# Altium schematic sheet CW340_USBHUB.SchDoc: USB Hub
size Letter; Organization: NewAE Technology Inc.; Address1: 1083 Queen St., Suite 196; Address2: Halifax; Address3: NS; Address4: Canada B3H 0B2; DocumentNumber: .; Revision: .; SheetNumber: 6; SheetTotal: 31; SheetApproved: YES
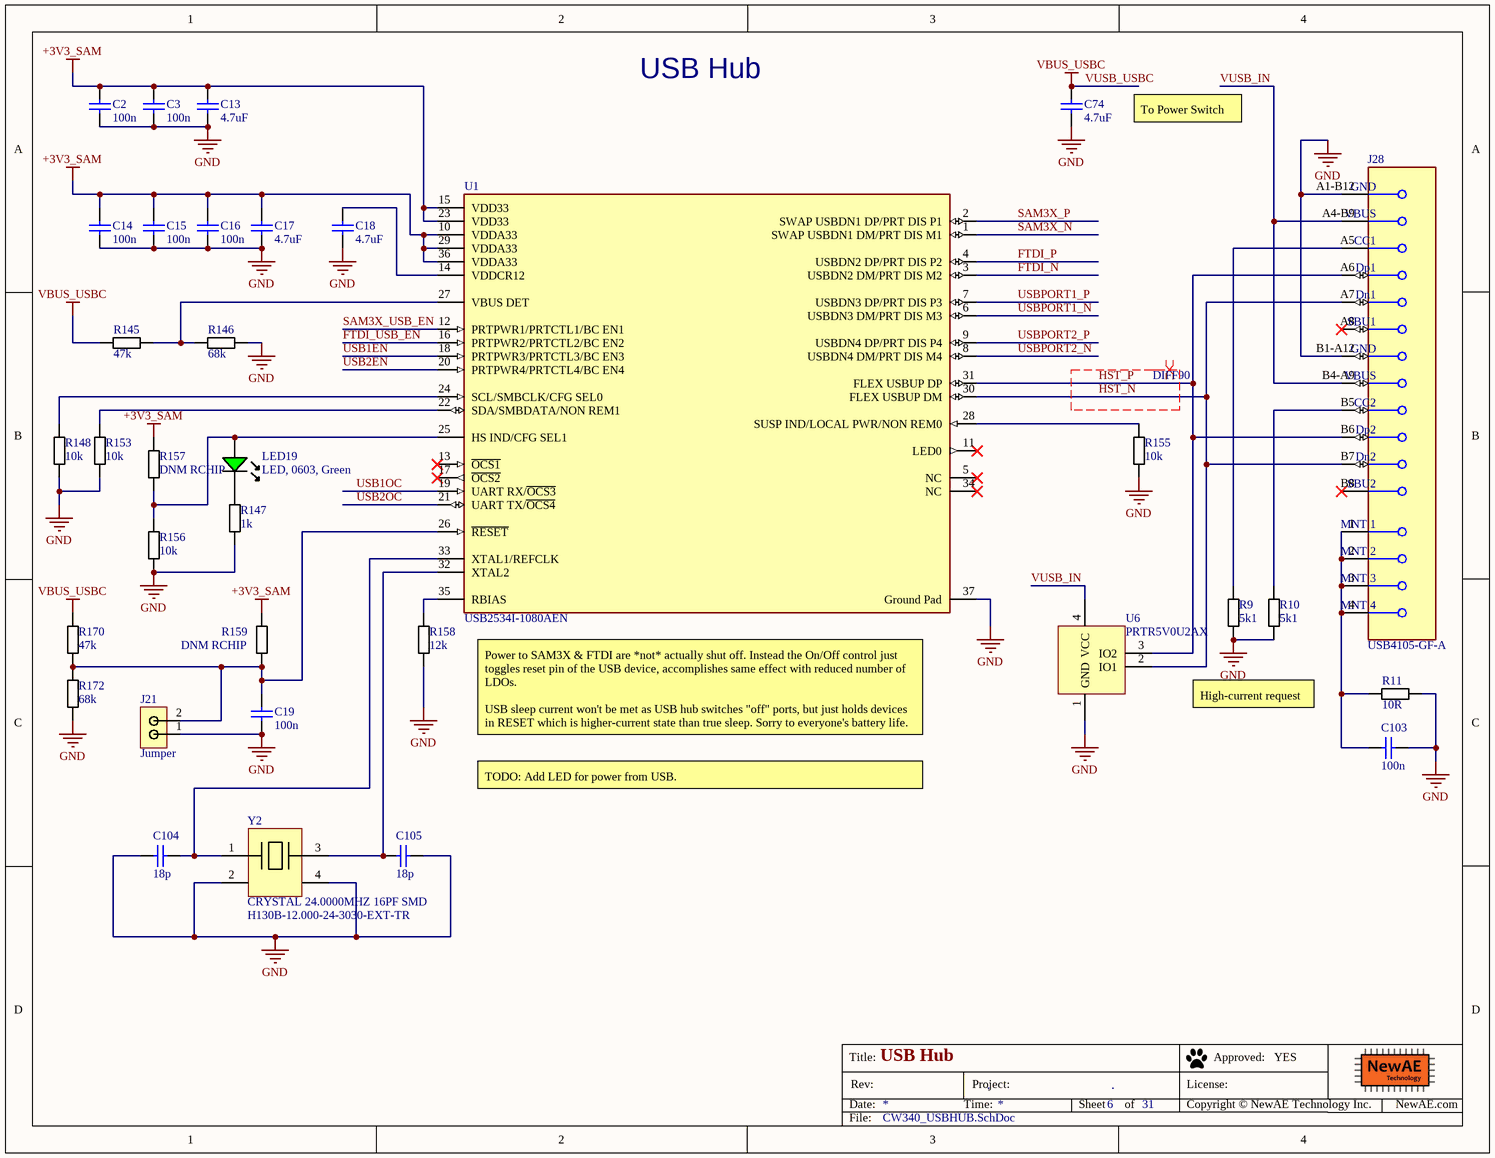
[diagram p0: CW340_USBHUB.SchDoc]

## Parts
C2  100n  [CAPC0402_M]
C3  100n  [CAPC0402_M]
C13  4.7uF  [CAPC0805_M]
C14  100n  [CAPC0402_M]
C15  100n  [CAPC0402_M]
C16  100n  [CAPC0402_M]
C17  4.7uF  [CAPC0805_M]
C18  4.7uF  [CAPC0805_M]
C19  100n  [CAPC0402_M]
C74  4.7uF  [CAPC0805_M]
C103  100n  [CAPC0603_M]
C104  18p  [CAPC0402_M]
C105  18p  [CAPC0402_M]
J21  Jumper  [2x2.54mm_Header]
J28  USB4105-GF-A  [FP-USB4105-GF-A-MFG]
LED19  LED, 0603, Green  [LED-0603-GREEN]
R9  5k1  [RESC1608X55N]
R10  5k1  [RESC1608X55N]
R11  10R  [RESC1608X55N]
R145  47k  [RESC1608X55N]
R146  68k  [RESC1608X55N]
R147  1k  [RESC1608X55N]
R148  10k  [RESC1608X55N]
R153  10k  [RESC1608X55N]
R155  10k  [RESC1608X55N]
R156  10k  [RESC1608X55N]
R157  DNM RCHIP  [RESC1608X55N]
R158  12k  [RESC1608X55N]
R159  DNM RCHIP  [RESC1608X55N]
R170  47k  [RESC1608X55N]
R172  68k  [RESC1608X55N]
U1  USB2534I-1080AEN  [FP-36SQFN-3706-6x6B-IPC_C]
U6  PRTR5V0U2AX  [SOT143B]
Y2  CRYSTAL 24.0000MHZ 16PF SMD  Manufacturer Part Number: H130B-12.000-24-3030-EXT-TR  [5x3.2MM XTAL]

## Nets
+3V3_SAM: C2.1 C3.1 C13.1 C14.1 C15.1 C16.1 C17.1 R157.1 R159.1 U1.10(VDDA33) U1.15(VDD33) U1.23(VDD33) U1.29(VDDA33) U1.36(VDDA33)
GND: C2.2 C3.2 C13.2 C14.2 C15.2 C16.2 C17.2 C18.1 C19.2 C74.2 C103.2 C104.1 C105.2 J21.1 J28.A1-B12(GND) J28.B1-A12(GND) R9.2 R10.2 R11.2 R146.2 R147.2 R148.1 R153.1 R155.1 R156.2 R158.2 R172.1 U1.37(Ground_Pad) U6.1(GND) Y2.2 Y2.4
VUSB_USBC: C74.1 R145.1 R170.1  [also labelled VBUS_USBC]
FTDI_N: U1.3(USBDN2_DM/PRT_DIS_M2)
FTDI_P: U1.4(USBDN2_DP/PRT_DIS_P2)
FTDI_USB_EN: U1.16(PRTPWR2/PRTCTL2/BC_EN2)
HST_N: J28.A7(Dn1) J28.B7(Dn2) U1.30(FLEX_USBUP_DM) U6.2(IO1)
HST_P: J28.A6(Dp1) J28.B6(Dp2) U1.31(FLEX_USBUP_DP) U6.3(IO2)
SAM3X_N: U1.1(SWAP_USBDN1_DM/PRT_DIS_M1)
SAM3X_P: U1.2(SWAP_USBDN1_DP/PRT_DIS_P1)
SAM3X_USB_EN: U1.12(PRTPWR1/PRTCTL1/BC_EN1)
USB1EN: U1.18(PRTPWR3/PRTCTL3/BC_EN3)
USB1OC: U1.19(UART_RX/~{OCS3})
USB2EN: U1.20(PRTPWR4/PRTCTL4/BC_EN4)
USB2OC: U1.21(UART_TX/~{OCS4})
USBPORT1_N: U1.6(USBDN3_DM/PRT_DIS_M3)
USBPORT1_P: U1.7(USBDN3_DP/PRT_DIS_P3)
USBPORT2_N: U1.8(USBDN4_DM/PRT_DIS_M4)
USBPORT2_P: U1.9(USBDN4_DP/PRT_DIS_P4)
VUSB_IN: J28.A4-B9(VBUS) J28.B4-A9(VBUS) U6.4(VCC)
NetC18_2: C18.2 U1.14(VDDCR12)
NetC19_1: C19.1 J21.2 R159.2 R170.2 R172.2 U1.26(~{RESET})
NetC103_1: C103.1 J28.1(MNT_1) J28.2(MNT_2) J28.3(MNT_3) J28.4(MNT_4) R11.1
NetC104_2: C104.2 U1.33(XTAL1/REFCLK) Y2.1
NetC105_1: C105.1 U1.32(XTAL2) Y2.3
NetJ28_A5: J28.A5(CC1) R9.1
NetJ28_B5: J28.B5(CC2) R10.1
NetLED19_A: LED19.A R156.1 R157.2 U1.25(HS_IND/CFG_SEL1)
NetLED19_K: LED19.K R147.1
NetR145_2: R145.2 R146.1 U1.27(VBUS_DET)
NetR148_2: R148.2 U1.24(SCL/SMBCLK/CFG_SEL0)
NetR153_2: R153.2 U1.22(SDA/SMBDATA/NON_REM1)
NetR155_2: R155.2 U1.28(SUSP_IND/LOCAL_PWR/NON_REM0)
NetR158_1: R158.1 U1.35(RBIAS)

Not connected (* = marked no-connect by the designer): J28 A8(SBU1)* B8(SBU2)*; U1 5(NC)* 11(LED0)* 13(~{OCS1})* 17(~{OCS2})* 34(NC)*

## Layout directives
differential pair; differential pair class DIFF90: HST_N, HST_P

## Notes on the sheet
- USB Hub
- To Power Switch
- High-current request
- Power to SAM3X & FTDI are *not* actually shut off. Instead the On/Off control just toggles reset pin of the USB device, accomplishes same effect with reduced number of LDOs.
  USB sleep current won't be met as USB hub switches "off" ports, but just holds devices in RESET which is higher-current state than true sleep. Sorry to everyone's battery life.
- TODO: Add LED for power from USB.
- Title:
- Date:
- Rev:
- Time:
- Project:
- Sheet
- of
- License:
- Copyright © NewAE Technology Inc.
- Approved:
- NewAE.com
- File:

## Library data of the parts
C2 C3 C14-C16 C19 = CCHIP-100n-0402: 100n, 0402; Manufacture Part Number 1: CGA2B3X7R1V104K050BB; Component Group: Capacitor; Case-EIA: 0402; Part Number: CCHIP-100n-0402; Footprint: 0402; Pin Count: 2; Value: 100n; Mounting Technology: SMT; Component Kind: Standard; Component Type: Standard; Supplier 1: Digi-Key; Supplier Part Number 1: 445-6901-1-ND
C13 C17 C18 C74 = CCHIP-4u7-0805-35V: 4u7, 35V, 0805, Ceramic; Manufacture 1: Murata; Manufacture Part Number 1: GRT21BC8YA475KE13L; Component Group: Capacitor; Case-EIA: 0805; Case-Metric: 1608; Rated Voltage: 35VDC; Tolerance: 10%; Part Number: CCHIP-4u7-0805-35V; Footprint: 0805; Pin Count: 2; Supplier 1: Digi-Key; Supplier Part Number 1: 490-12361-1-ND; Value: 4.7uF; Mounting Technology: SMT; Temperature Range: -55C to 85C; Component Kind: Standard; Component Type: Standard
C103 = CCHIP-100n-0603: 100n, 0603; Manufacture 1: Kemet; Manufacture Part Number 1: C0603C104K5RACTU; Component Group: Capacitor; Case-EIA: 0603; Case-Metric: 1608; Rated Voltage: 50VDC; Part Number: CCHIP-100n-0603; Footprint: 0603; Pin Count: 2; Supplier 1: Digi-Key; Supplier Part Number 1: 399-5089-2-ND; Value: 100n; Mounting Technology: SMT; Component Kind: Standard; Component Type: Standard
C104 C105 = CCHIP-18p-0402: 18p, 0402; Manufacture Part Number 1: GRM1555C1H180JA01D; Component Group: Capacitor; Case-EIA: 0402; Part Number: CCHIP-18p-0402; Footprint: 0402; Pin Count: 2; Supplier 1: Digi-Key; Supplier Part Number 1: 490-5858-1-ND; Value: 18p; Mounting Technology: SMT; Component Kind: Standard; Component Type: Standard
J21 = 2_PIN_JUMPER: 1x2 2.54mm header, male pins; Manufacture 1: Harwin; Manufacture Part Number 1: M20-9990246; Component Group: PCB Feature; PP Material Stack: 0; Part Number: 2_PIN_JUMPER; Pin Count: 2; Supplier 1: Digi-Key; Supplier Part Number 1: 952-2262-ND; Mounting Technology: Through-hole; RoHS: Yes; Component Kind: Standard; Component Type: Standard; PP Rotation: 0
J28 = CMP-245163-000001-1: CONN RCPT USB2.0 TYPEC 5A; Manufacturer: GCT; Voltage Rating: 20V; Is Female: yes; Current Rating: 5/6.25/1.25/0.25A; Number Of Contacts: 16; Conn Orientation: Right Angle; Device Class L1: Connectors; Category: Conn; Lead Free: Yes; RoHS: TRUE; Temperature Range High: +85°C; Digikey Description: CONN RCPT USB2.0 TYPEC 5A; Device Class L3: unset; ComponentLink2Description: Datasheet; Manufacturer Part Number: USB4105-GF-A; Package: 0; Usb Standard: USB 2.0; Device Class L2: USB Connectors; Automotive: No; Temperature Range Low: -40°C; Height: 3.46mm; Temperature: -40°C to +85°C; Contact Material: Gold,Nickel; ComponentLink2URL: https://gct.co/files/drawings/usb4105.pdf; Octopart: https://octopart.com/usb4105-gf-a-gct-106627878
LED19 = LEDCHIP_0603_GREEN: Chip LED, Green; Manufacture 1: Kingbright; Manufacture Part Number 1: APT1608CGCK; Component Group: Optical; PP Material Stack: 16; PP Rotation: -90; Part Number: LEDCHIP_0603_GREEN; Pin Count: 2; Supplier 1: Digi-Key; Supplier Part Number 1: 754-1116-1-ND; Mounting Technology: SMT; Component Kind: Standard; Component Type: Standard
R9 R10 = RCHIP-5K1-0603: 5k1 res, 0603, 1%, 1/10W; Manufacture 1: Yageo; Manufacture Part Number 1: RC0603FR-075K1L; Component Group: Resistor; Case-EIA: 0603; Case-Metric: 1608; Rated Power: 0.1W; Rated Voltage: 75VDC; Part Number: RCHIP-5K1-0603; Footprint: 0603; Pin Count: 2; Supplier 1: Digi-Key; Supplier Part Number 1: 311-5.10KHRCT-ND; Value: 5k1; Tolerance: 1%; Mounting Technology: SMT; Temperature Range: -55C to 155C; Component Kind: Standard; Component Type: Standard
R11 = RCHIP-10R-0603: 10R res, 0603, 1%, 1/10W; Manufacture 1: Yageo; Manufacture Part Number 1: RC0603FR-0710RL; Component Group: Resistor; Case-EIA: 0603; Case-Metric: 1608; Rated Power: 0.1W; Rated Voltage: 75VDC; Part Number: RCHIP-10R-0603; Footprint: 0603; Pin Count: 2; Supplier 1: Digi-Key; Supplier Part Number 1: 311-10.0HRCT-ND; Value: 10R; Tolerance: 1%; Mounting Technology: SMT; Temperature Range: -55C to 155C; Component Kind: Standard; Component Type: Standard
R145 R170 = RCHIP-47K-0603: 47k res, 0603, 1%, 1/10W; Manufacture 1: Yageo; Manufacture Part Number 1: RC0603FR-0747KL; Component Group: Resistor; Case-EIA: 0603; Case-Metric: 1608; Rated Power: 0.1W; Rated Voltage: 75VDC; Part Number: RCHIP-47K-0603; Footprint: 0603; Pin Count: 2; Supplier 1: Digi-Key; Supplier Part Number 1: 311-47.0KHRCT-ND; Value: 47k; Tolerance: 1%; Mounting Technology: SMT; Temperature Range: -55C to 155C; Component Kind: Standard; Component Type: Standard
R146 R172 = RCHIP-68K-0603: 68k res, 0603, 1%, 1/10W; Manufacture 1: Yageo; Manufacture Part Number 1: RC0603FR-0768KL; Component Group: Resistor; Case-EIA: 0603; Case-Metric: 1608; Rated Power: 0.1W; Rated Voltage: 75VDC; Part Number: RCHIP-68K-0603; Footprint: 0603; Pin Count: 2; Supplier 1: Digi-Key; Supplier Part Number 1: 311-68.0KHRCT-ND; Value: 68k; Tolerance: 1%; Mounting Technology: SMT; Temperature Range: -55C to 155C; Component Kind: Standard; Component Type: Standard
R147 = RCHIP-1K-0603: 1k res, 0603, 1%, 1/10W; Manufacture 1: Yageo; Manufacture Part Number 1: RC0603FR-071KL; Component Group: Resistor; Case-EIA: 0603; Case-Metric: 1608; Rated Power: 0.1W; Rated Voltage: 75VDC; Part Number: RCHIP-1K-0603; Footprint: 0603; Pin Count: 2; Supplier 1: Digi-Key; Supplier Part Number 1: 311-1.00KHRCT-ND; Value: 1k; Tolerance: 1%; Mounting Technology: SMT; Temperature Range: -55C to 155C; Component Kind: Standard; Component Type: Standard
R148 R153 R155 = RCHIP-10K-0603: 10k res, 0603, 1%, 1/10W; Manufacture 1: Yageo; Manufacture Part Number 1: RC0603FR-0710KL; Component Group: Resistor; Case-EIA: 0603; Case-Metric: 1608; Rated Power: 0.1W; Rated Voltage: 75VDC; Part Number: RCHIP-10K-0603; Footprint: 0603; Pin Count: 2; Supplier 1: Digi-Key; Supplier Part Number 1: 311-10.0KHRCT-ND; Value: 10k; Tolerance: 1%; Mounting Technology: SMT; Temperature Range: -55C to 155C; Component Kind: Standard; Component Type: Standard
R156 = RCHIP-10k-0603: 10k res, 0603, 1%, 1/10W; Manufacture 1: Yageo; Manufacture Part Number 1: RC0603FR-0710KL; Component Group: Resistor; Case-EIA: 0603; Case-Metric: 1608; Rated Power: 0.1W; Rated Voltage: 75VDC; Part Number: RCHIP-10K-0603; Footprint: 0603; Pin Count: 2; Mounting Technology: SMT; Component Kind: Standard; Component Type: Standard; Supplier 1: Digi-Key; Supplier Part Number 1: 311-10.0KHRCT-ND; Value: 10k; Tolerance: 1%; Temperature Range: -55C to 155C
R157 R159 = RCHIP-DNM-0603: Do Not Mount Resistor; Case-EIA: 0603; Case-Metric: 1608; Part Number: RCHIP-DNM-0603; Component Group: Resistor; Footprint: 0603; Pin Count: 2; Mounting Technology: SMT; Component Kind: Standard; Component Type: Standard
R158 = RCHIP-12K-0603: 12k res, 0603, 1%, 1/10W; Manufacture 1: Yageo; Manufacture Part Number 1: RC0603FR-0712KL; Component Group: Resistor; Case-EIA: 0603; Case-Metric: 1608; Rated Power: 0.1W; Rated Voltage: 75VDC; Part Number: RCHIP-12K-0603; Footprint: 0603; Pin Count: 2; Supplier 1: Digi-Key; Supplier Part Number 1: 311-12.0KHRCT-ND; Value: 12k; Tolerance: 1%; Mounting Technology: SMT; Temperature Range: -55C to 155C; Component Kind: Standard; Component Type: Standard
U1 = CMP-06284-000029-1: IC USB 2.0 HUB CTLR 4PORT 36SQFN; Max Supply Voltage: 3.6V; Operating Supply Voltage: 3.3V; Number of Ports: 4; ESD Protection: Yes; Interface: I2C; Number of Transceivers: 1; Min Supply Voltage: 3V; Radiation Hardening: No; Packaging: Tray; Height: 0.95mm; Package Quantity: 490; Min Operating Temperature: -40°C; REACH SVHC: No SVHC; Lead Free: Lead Free; Mount: Surface Mount; Number of Channels: 4; Max Operating Temperature: 85°C; Width: 6.1mm; Number of Pins: 36; RoHS Compliant: Yes; Length: 6.1mm
U6 = PRTR5V0U2AX: USB 2.0 high-speed ESD; Component Group: Diode; Supplier 1: Digi-Key; Supplier Part Number 1: 568-7445-1-ND; Part Number: PRTR5V0U2AX; Pin Count: 4; Component Kind: Standard; Component Type: Standard; 0_TEMP: SOT143B
Y2 = H130B-24.000-18-3030-EXT-TR: 24MHz ±30ppm Crystal 16pF 35 Ohms 4-SMD, No Lead; Manufacturer: Raltron Electronics; Value: 12.000MHz; PP Material Stack: 0; Supplier 1: Digi-Key; RoHS: No; Stock 1: 4955; Pricing 1: 1=0.590000, 10=0.488000, 50=0.439400, 100=0.390600, 500=0.371100 (USD); Supplier Part Number 1: 2151-H130B-24.000-18-3030-EXT-TRCT-ND; .Checked SCH: *; .Checked PCB: *; Part Number: H130B-24.000-18-3030-EXT-TR; Component Group: Crystal; Footprint: 5x3.2mm; Manufacture 1: Raltron Electronics; Manufacture Part Number 1: H130B-24.000-18-3030-EXT-TR; Pin Count: 4; Mounting Technology: SMT; Component Kind: Standard; Component Type: Standard; PP Rotation: 0